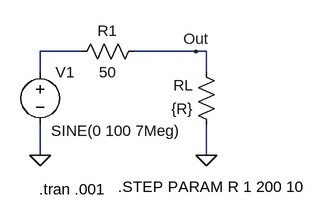
[diagram p0: schematic steponly.asc]
steponly.asc, the LTspice schematic file:
Version 4
SHEET 1 1056 680
WIRE 144 112 80 112
WIRE 320 112 224 112
WIRE 336 112 320 112
WIRE 80 144 80 112
WIRE 336 144 336 112
WIRE 80 272 80 224
WIRE 336 272 336 224
FLAG 80 272 0
FLAG 336 272 0
FLAG 320 112 Out
SYMBOL voltage 80 128 R0
WINDOW 3 17 106 Left 2
WINDOW 123 0 0 Left 2
WINDOW 39 0 0 Left 2
SYMATTR InstName V1
SYMATTR Value SINE(0 100 7Meg)
SYMBOL res 240 96 R90
WINDOW 0 0 56 VBottom 2
WINDOW 3 32 56 VTop 2
SYMATTR InstName R1
SYMATTR Value 50
SYMBOL res 352 240 R180
WINDOW 0 36 76 Left 2
WINDOW 3 36 40 Left 2
SYMATTR InstName RL
SYMATTR Value {R}
TEXT 200 320 Left 2 !.STEP PARAM R 1 200 10
TEXT 78 324 Left 2 !.tran .001

The netlist it stands for:
* steponly.asc
V1 N001 0 SINE(0 100 7Meg)
R1 Out N001 50
RL 0 Out {R}
.STEP PARAM R 1 200 10
.tran .001
.backanno
.end